# EAGLE design ABMS - VFG - GENERATOR (EAGLE 5.10)
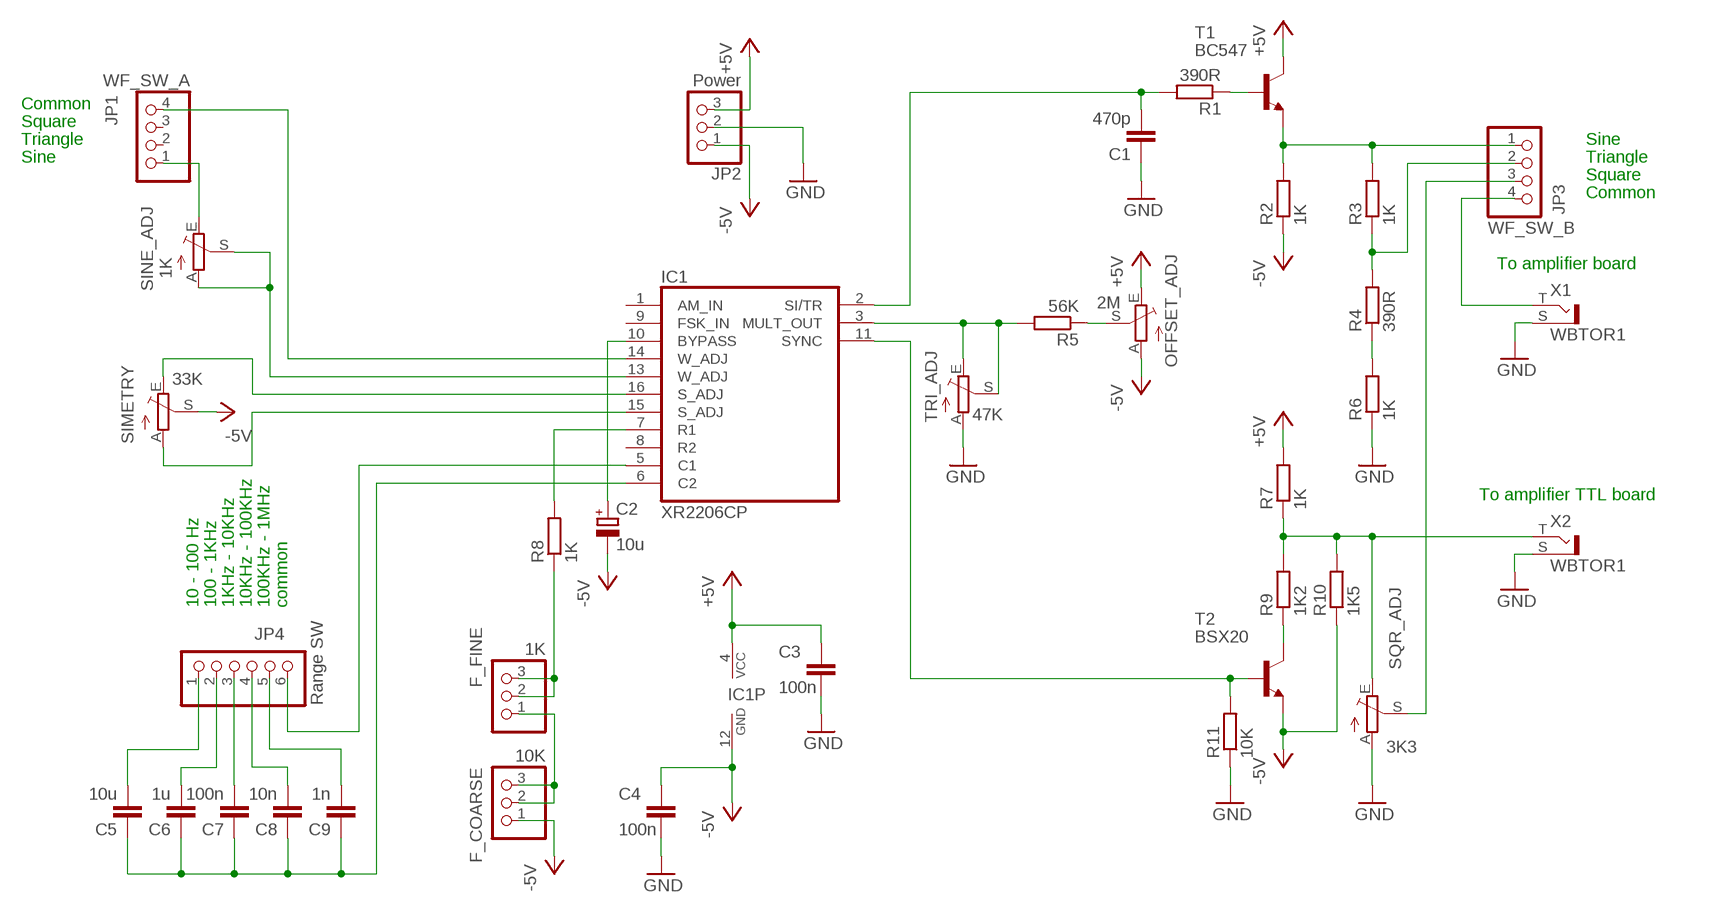
[diagram p0: schematic, sheet 1]

## Parts
C1  470p  C-EU050-025X075  [C050-025X075]
C2  10u  CPOL-EUE5-6  [E5-6]
C3  100n  C-EU050-025X075  [C050-025X075]
C4  100n  C-EU050-025X075  [C050-025X075]
C5  10u  C-EU050-025X075  [C050-025X075]
C6  1u  C-EU050-025X075  [C050-025X075]
C7  100n  C-EU050-025X075  [C050-025X075]
C8  10n  C-EU050-025X075  [C050-025X075]
C9  1n  C-EU050-025X075  [C050-025X075]
F_COARSE  10K  PINHD-1X3  [1X03]
F_FINE  1K  PINHD-1X3  [1X03]
IC1  XR2206CP  XR-2206  [DIL16]
JP1  WF_SW_A  PINHD-1X4  [1X04]
JP2  Power  PINHD-1X3  [1X03]
JP3  WF_SW_B  PINHD-1X4  [1X04]
JP4  Range SW  PINHD-1X6  [1X06]
OFFSET_ADJ  2M  TRIM_EU-RS3  [RS3]
R1  390R  R-EU_0207/10  [0207/10]
R2  1K  R-EU_0207/10  [0207/10]
R3  1K  R-EU_0207/10  [0207/10]
R4  390R  R-EU_0207/10  [0207/10]
R5  56K  R-EU_0207/10  [0207/10]
R6  1K  R-EU_0207/10  [0207/10]
R7  1K  R-EU_0207/10  [0207/10]
R8  1K  R-EU_0207/10  [0207/10]
R9  1K2  R-EU_0207/10  [0207/10]
R10  1K5  R-EU_0207/10  [0207/10]
R11  10K  R-EU_0207/10  [0207/10]
SIMETRY  33K  TRIM_EU-RS3  [RS3]
SINE_ADJ  1K  TRIM_EU-RS3  [RS3]
SQR_ADJ  3K3  TRIM_EU-RS3  [RS3]
T1  BC547  -NPN-TO92-CBE  [TO92-CBE]
T2  BSX20  BSX20-NPN-TO18-EBC  [TO18]
TRI_ADJ  47K  TRIM_EU-RS3  [RS3]
X1  WBTOR1  [WBTOR1]
X2  WBTOR1  [WBTOR1]

## Nets
+5V: C3.1 IC1.4(VCC) JP2.3 OFFSET_ADJ.E R7.2 T1.C
-5V: C2.- C4.1 F_COARSE.1 IC1.12(GND) JP2.1 OFFSET_ADJ.A R2.1 R10.1 SIMETRY.S T2.1(E)
GND: C1.1 C3.2 C4.2 JP2.2 R6.1 R11.1 SQR_ADJ.A TRI_ADJ.A X1.S X2.S
N$1: C2.+ IC1.10(BYPASS)
N$2: F_FINE.2 F_FINE.3 R8.1
N$3: JP3.4 X1.T
N$4: F_COARSE.2 F_COARSE.3 F_FINE.1
N$5: C7.2 JP4.3
N$6: IC1.7(R1) R8.2
N$8: C6.2 JP4.2
N$9: C5.2 JP4.1
N$10: C8.2 JP4.4
N$11: C9.2 JP4.5
N$12: IC1.5(C1) JP4.6
N$13: C5.1 C6.1 C7.1 C8.1 C9.1 IC1.6(C2)
N$14: IC1.15(S_ADJ) SIMETRY.A
N$15: IC1.13(W_ADJ) SINE_ADJ.A SINE_ADJ.S
N$16: JP1.1 SINE_ADJ.E
N$17: IC1.16(S_ADJ) SIMETRY.E
N$19: IC1.14(W_ADJ) JP1.4
N$24: OFFSET_ADJ.S R5.1
N$26: R7.1 R9.2 R10.2 SQR_ADJ.E X2.T
N$27: JP3.1 R2.2 R3.2 T1.E
N$28: R9.1 T2.3(C)
N$29: IC1.11(SYNC) R11.2 T2.2(B)
N$30: R1.1 T1.B
N$31: C1.2 IC1.2(SI/TR) R1.2
N$33: JP3.2 R3.1 R4.2
N$34: R4.1 R6.2
N$35: JP3.3 SQR_ADJ.S
N$36: IC1.3(MULT_OUT) R5.2 TRI_ADJ.E TRI_ADJ.S
Unconnected: IC1.1(AM_IN) IC1.8(R2) IC1.9(FSK_IN) JP1.2 JP1.3

## Notes on the sheet
- Common
- Square
- Triangle | Sine
- Sine | Triangle
- Square
- Common
- To amplifier board
- To amplifier TTL board
- 10 - 100 Hz | 100 - 1KHz | 1KHz - 10KHz | 10KHz - 100KHz | 100KHz - 1MHz | common

## Library data of the parts
C1 C3-C9 = resistor:C-EU: CAPACITOR, European symbol
C2 = resistor:CPOL-EU: POLARIZED CAPACITOR, European symbol
F_COARSE F_FINE JP2 = pinhead:PINHD-1X3: PIN HEADER
IC1 = exar:XR-2206: Monolithic FUNCTION GENERATOR
JP1 JP3 = pinhead:PINHD-1X4: PIN HEADER
JP4 = pinhead:PINHD-1X6: PIN HEADER
OFFSET_ADJ SIMETRY SINE_ADJ SQR_ADJ TRI_ADJ = pot:TRIM_EU-: POTENTIOMETER
R1-R11 = resistor:R-EU_: RESISTOR, European symbol
T1 = transistor-neu-to92:*-NPN-: NPN Transistror BF959 corrected 2008.03.06
T2 = transistor:*-NPN-: NPN Transistror BF959 corrected 2008.03.06
X1 X2 = con-lumberg:WBTOR1: RCA connectors according to JEITA RC-5231 Cinch RCA-Einbaukupplung nach JEITA RC-5231, abgewinkelte Ausführung Source: http://www.lumberg.de/Produkte/PDFs/WBTOR1.pdf

## Net classes
0 default: width 0.508 mm, drill 0.762 mm, clearance 0.508 mm

## Board
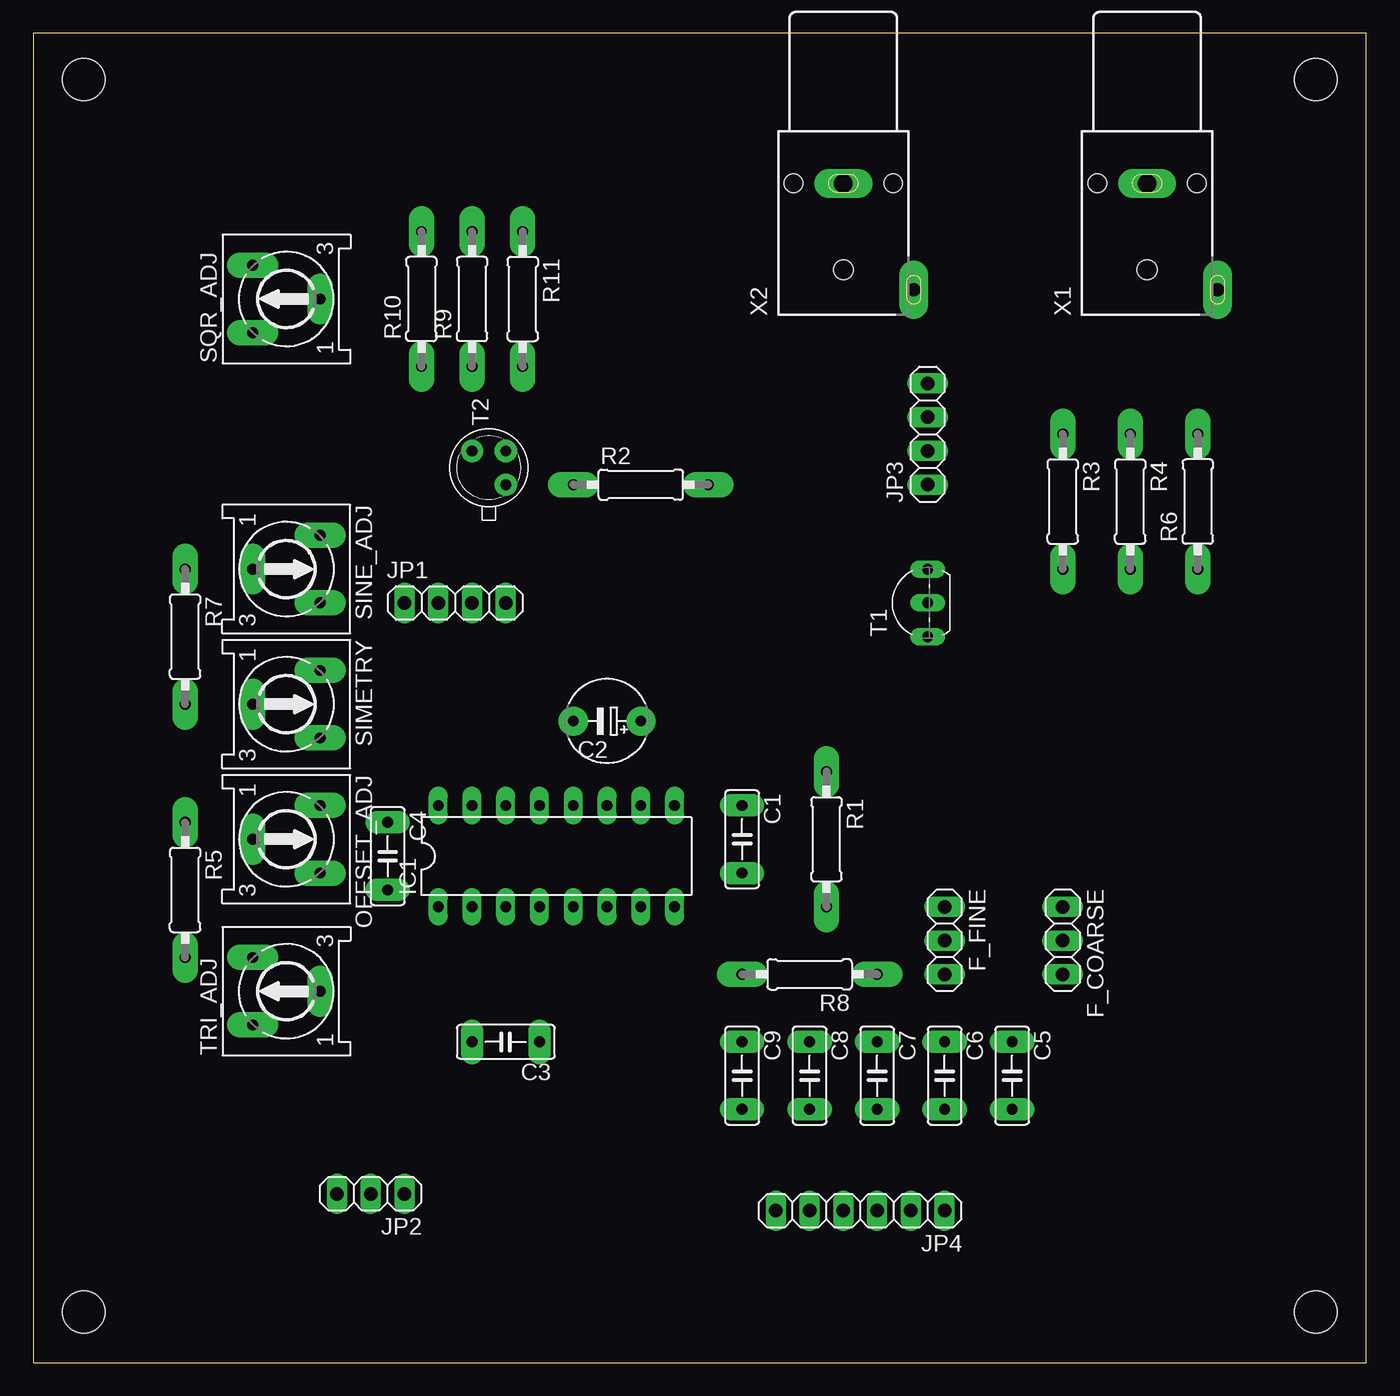
[diagram p1: board, top side]
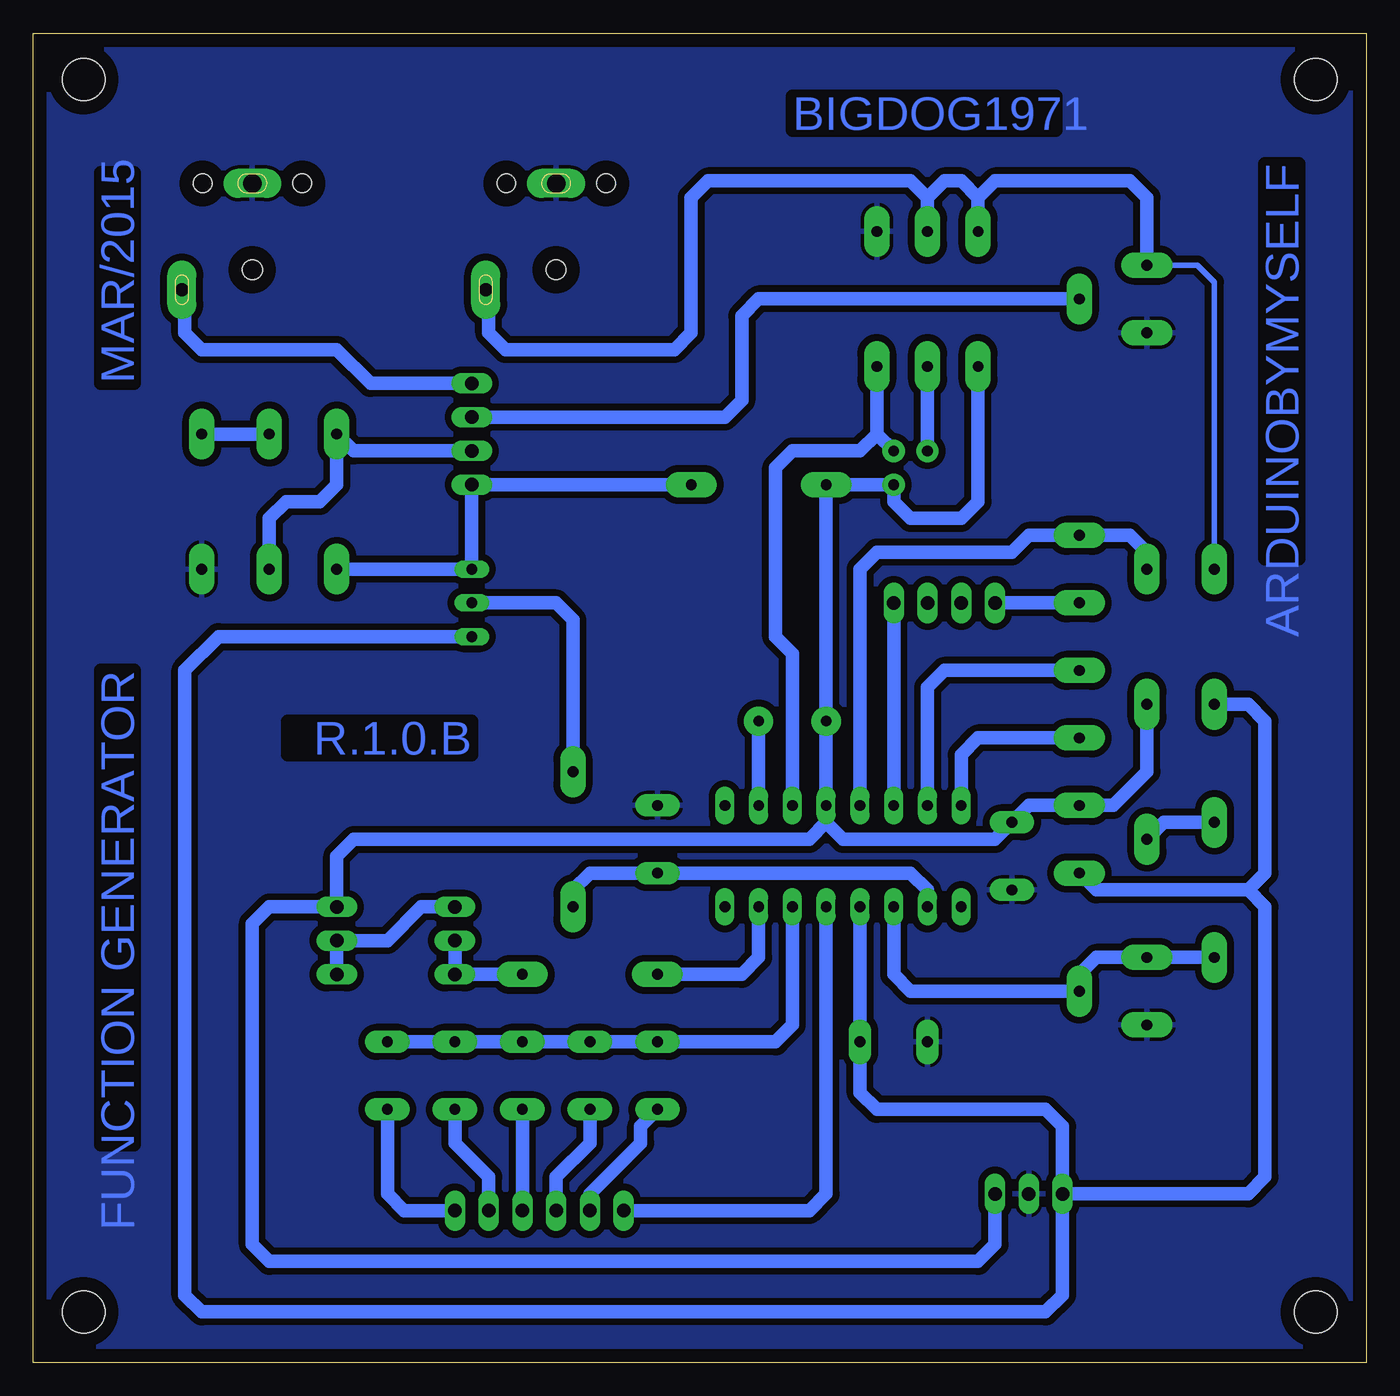
[diagram p2: board, bottom side, seen from below]

Size 100.31 x 100 mm. Coordinates in mm from the lower left corner, seen from the top.
Outline: 0,0 100.31,0 100.31,100 0,100 0,0
Copper layers (1*16): Top 0.035mm / dielectric 1.5mm / Bottom 0.035mm
Design rules "default": minimum track width 10mil, minimum drill 24mil, track to track 8mil, track to pad 8mil, pad to pad 8mil, via to via 8mil, smd to smd 8mil, copper to edge 40mil, drill to drill 8mil, minimum pad ring 10mil, minimum via ring 8mil, stop-mask expansion 4mil, vias tented up to drill 0mil, thermal gap 10mil
Holes 3.2 mm at 3.81,3.81 3.81,96.52 96.52,3.81 96.52,96.52

### Footprints (pad centres in the part's own frame; a part is rotated, then mirrored left to right if it is on the bottom)
C050-025X075 = drill 0.813 pad 1.676 long: 1 -2.54,0; 2 2.54,0
E5-6 = drill 0.813 pad 2.184 round: + -2.54,0; - 2.54,0
1X03 = drill 1.016 long: 1 -2.54,0; 2 0,0; 3 2.54,0
DIL16 = drill 0.813 pad 1.422 long: 1 -8.89,-3.81; 2 -6.35,-3.81; 3 -3.81,-3.81; 4 -1.27,-3.81; 5 1.27,-3.81; 6 3.81,-3.81; 7 6.35,-3.81; 8 8.89,-3.81; 9 8.89,3.81; 10 6.35,3.81; 11 3.81,3.81; 12 1.27,3.81; 13 -1.27,3.81; 14 -3.81,3.81; 15 -6.35,3.81; 16 -8.89,3.81
1X04 = drill 1.016 long: 1 -3.81,0; 2 -1.27,0; 3 1.27,0; 4 3.81,0
1X06 = drill 1.016 long: 1 -6.35,0; 2 -3.81,0; 3 -1.27,0; 4 1.27,0; 5 3.81,0; 6 6.35,0
RS3 = drill 0.813 pad 1.93 long: A -2.54,2.54; E 2.54,2.54; S 0,-2.54
0207/10 = drill 0.813 pad 1.93 long: 1 -5.08,0; 2 5.08,0
TO92-CBE = drill 0.813 long: B 0,0; C -2.54,0; E 2.54,0
TO18 = drill 0.813 pad 1.676 round: 1 -1.27,-1.27; 2 1.27,-1.27; 3 1.27,1.27
WBTOR1 = drill 1.4 pad 2.2 long: S 0,-4 | drill 1 pad 2.2 long: T 5.3,-12 | hole 1.4: -3.75,-4; 3.75,-4 | hole 1.5: 0,-10.5

### Placement (x,y rotation side)
C1  53.34,39.37 270 top
C2  43.18,48.26 180 top
C3  35.56,24.13 180 top
C4  26.67,38.1 270 top
C5  73.66,21.59 270 top
C6  68.58,21.59 270 top
C7  63.5,21.59 270 top
C8  58.42,21.59 270 top
C9  53.34,21.59 270 top
F_COARSE  77.47,31.75 270 top
F_FINE  68.58,31.75 270 top
IC1  39.37,38.1 0 top
JP1  31.75,57.15 0 top
JP2  25.4,12.7 180 top
JP3  67.31,69.85 90 top
JP4  62.23,11.43 180 top
OFFSET_ADJ  19.05,39.37 270 top
R1  59.69,39.37 270 top
R2  45.72,66.04 0 top
R3  77.47,64.77 270 top
R4  82.55,64.77 270 top
R5  11.43,35.56 270 top
R6  87.63,64.77 90 top
R7  11.43,54.61 270 top
R8  58.42,29.21 180 top
R9  33.02,80.01 90 top
R10  29.21,80.01 90 top
R11  36.83,80.01 270 top
SIMETRY  19.05,49.53 270 top
SINE_ADJ  19.05,59.69 270 top
SQR_ADJ  19.05,80.01 90 top
T1  67.31,57.15 90 top
T2  34.29,67.31 90 top
TRI_ADJ  19.05,27.94 90 top
X1  83.82,92.71 0 top
X2  60.96,92.71 0 top

### Tracks (layer width: path | path; a pad name or v marks a point on that pad's centre or on a via)
+5V
  Bottom 0.406: JP2.3 22.86,12.78
  Bottom 1.016: C3.1 IC1.4 38.1,20.32 36.83,19.05 24.13,19.05 22.86,17.78 JP2.3 | T1.C 86.36,54.61 88.9,52.07 88.9,5.08 87.63,3.81 24.13,3.81 22.86,5.08 JP2.3 | R7.2 8.89,49.53 7.62,48.26 7.62,36.83 8.89,35.56 | OFFSET_ADJ.E 20.32,35.56 8.89,35.56 | 8.89,35.56 7.62,34.29 7.62,13.97 8.89,12.7 JP2.3
-5V
  Bottom 1.016: SIMETRY.S 16.51,44.45 19.05,41.91 OFFSET_ADJ.A 25.4,41.91 C4.1 27.94,39.37 39.37,39.37 40.64,40.64 | 40.64,40.64 IC1.12 C2.- R2.1 T2.1 35.56,64.77 34.29,63.5 30.48,63.5 29.21,64.77 R10.1 | 40.64,40.64 41.91,39.37 76.2,39.37 77.47,38.1 F_COARSE.1 82.55,34.29 83.82,33.02 83.82,8.89 82.55,7.62 29.21,7.62 27.94,8.89 JP2.1
GND
  pour Bottom: -1.27,101.6 101.6,101.6 101.6,-1.27 -1.27,-1.27
N$1
  Bottom 1.016: IC1.10 C2.+
N$2
  Bottom 1.016: R8.1 F_FINE.3 F_FINE.2
N$3
  Bottom 1.016: JP3.4 74.93,73.66 77.47,76.2 87.63,76.2 88.9,77.47 88.9,80.49 X1.T
N$4
  Bottom 1.016: F_FINE.1 71.12,34.29 73.66,31.75 F_COARSE.2 F_COARSE.3
N$5
  Bottom 1.016: JP4.3 C7.2
N$6
  Bottom 1.016: IC1.7 45.72,30.48 46.99,29.21 R8.2
N$8
  Bottom 1.016: JP4.2 66.04,13.97 68.58,16.51 C6.2
N$9
  Bottom 1.016: C5.2 73.66,12.7 72.39,11.43 JP4.1
N$10
  Bottom 1.016: JP4.4 60.96,13.97 58.42,16.51 C8.2
N$11
  Bottom 1.016: JP4.5 58.42,12.7 54.61,16.51 54.61,17.78 C9.2
N$12
  Bottom 1.016: IC1.5 40.64,12.7 41.91,11.43 JP4.6
N$13
  Bottom 1.016: IC1.6 43.18,25.4 44.45,24.13 C9.1 C8.1 C7.1 C6.1 | C6.1 69.85,24.13 | C6.1 C5.1
N$14
  Bottom 1.016: SIMETRY.A 31.75,52.07 33.02,50.8 IC1.15
N$15
  Bottom 1.016: SINE_ADJ.S 16.51,60.96 17.78,62.23 SINE_ADJ.A 25.4,62.23 26.67,60.96 36.83,60.96 38.1,59.69 IC1.13
N$16
  Bottom 1.016: SINE_ADJ.E JP1.1
N$17
  Bottom 1.016: SIMETRY.E 29.21,46.99 30.48,45.72 IC1.16
N$19
  Bottom 1.016: IC1.14 JP1.4
N$24
  Bottom 1.016: R5.1 15.24,40.64 OFFSET_ADJ.S
N$26
  Bottom 0.406: R7.1 11.43,81.28 12.7,82.55 SQR_ADJ.E
  Bottom 1.016: SQR_ADJ.E 16.51,87.63 17.78,88.9 27.94,88.9 29.21,87.63 | 29.21,87.63 R10.2 | 29.21,87.63 30.48,88.9 31.75,88.9 33.02,87.63 | 33.02,87.63 R9.2 | 33.02,87.63 34.29,88.9 49.53,88.9 50.8,87.63 50.8,77.47 52.07,76.2 64.77,76.2 66.04,77.47 66.04,80.49 X2.T
N$27
  Bottom 1.016: R2.2 JP3.1 T1.E R3.2
N$28
  Bottom 1.016: T2.3 R9.1
N$29
  Bottom 1.016: 36.83,69.85 R11.2 | 36.83,69.85 T2.2 | 36.83,69.85 38.1,68.58 43.18,68.58 44.45,67.31 44.45,54.61 43.18,53.34 IC1.11
N$30
  Bottom 1.016: R1.1 59.69,55.88 60.96,57.15 T1.B
N$31
  Bottom 1.016: IC1.2 33.02,35.56 34.29,36.83 C1.2 58.42,36.83 59.69,35.56 R1.2
N$33
  Bottom 1.016: JP3.2 76.2,68.58 R3.1 77.47,66.04 78.74,64.77 81.28,64.77 82.55,63.5 R4.2
N$34
  Bottom 1.016: R4.1 R6.2
N$35
  Bottom 1.016: SQR_ADJ.S 45.72,80.01 46.99,78.74 46.99,72.39 48.26,71.12 JP3.3
N$36
  Bottom 1.016: R5.2 TRI_ADJ.E 20.32,30.48 21.59,29.21 TRI_ADJ.S 34.29,27.94 35.56,29.21 IC1.3

### Text on the board
Bottom: BIGDOG1971 | ARDUINOBYMYSELF | MAR/2015 | FUNCTION GENERATOR | R.1.0.B